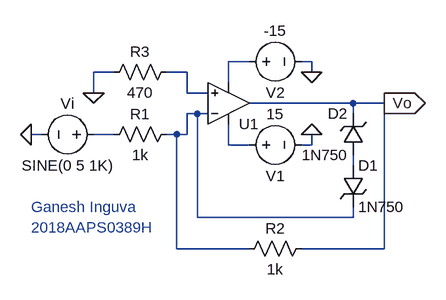
[diagram p0: schematic Run_3.asc]
Run_3.asc, the LTspice schematic file:
Version 4
SHEET 1 880 680
WIRE 80 32 48 32
WIRE 176 32 160 32
WIRE -128 48 -160 48
WIRE -16 48 -48 48
WIRE 176 48 176 32
WIRE 48 64 48 32
WIRE -160 80 -160 48
WIRE -16 80 -16 48
WIRE 16 80 -16 80
WIRE 240 96 80 96
WIRE 288 96 240 96
WIRE 0 112 -16 112
WIRE 16 112 0 112
WIRE 240 112 240 96
WIRE -240 144 -256 144
WIRE -128 144 -160 144
WIRE -32 144 -48 144
WIRE -16 144 -16 112
WIRE -16 144 -32 144
WIRE 48 160 48 128
WIRE 80 160 48 160
WIRE 176 160 176 144
WIRE 176 160 160 160
WIRE 240 192 240 176
WIRE 0 272 0 112
WIRE 240 272 240 256
WIRE 240 272 0 272
WIRE -32 320 -32 144
WIRE 80 320 -32 320
WIRE 288 320 288 96
WIRE 288 320 160 320
FLAG 176 48 0
FLAG 176 144 0
FLAG -256 144 0
FLAG -160 80 0
FLAG 288 96 Vo
IOPIN 288 96 Out
SYMBOL OpAmps\\UniversalOpamp2 48 96 M180
SYMATTR InstName U1
SYMBOL voltage 64 160 M90
WINDOW 0 32 56 VTop 2
WINDOW 3 -32 56 VBottom 2
WINDOW 123 0 0 Left 0
WINDOW 39 0 0 Left 0
SYMATTR InstName V1
SYMATTR Value 15
SYMBOL voltage 64 32 M90
WINDOW 0 32 56 VTop 2
WINDOW 3 -32 56 VBottom 2
WINDOW 123 0 0 Left 0
WINDOW 39 0 0 Left 0
SYMATTR InstName V2
SYMATTR Value -15
SYMBOL res -32 32 R90
WINDOW 0 0 56 VBottom 2
WINDOW 3 32 56 VTop 2
SYMATTR InstName R3
SYMATTR Value 470
SYMBOL res -32 128 R90
WINDOW 0 0 56 VBottom 2
WINDOW 3 32 56 VTop 2
SYMATTR InstName R1
SYMATTR Value 1k
SYMBOL voltage -144 144 R90
WINDOW 0 -32 56 VBottom 2
WINDOW 3 32 56 VTop 2
WINDOW 123 0 0 Left 0
WINDOW 39 0 0 Left 0
SYMATTR InstName Vi
SYMATTR Value SINE(0 5 1K)
SYMBOL zener 256 176 R180
WINDOW 0 24 64 Left 2
WINDOW 3 24 0 Left 2
SYMATTR InstName D2
SYMATTR Value 1N750
SYMBOL zener 224 192 R0
SYMATTR InstName D1
SYMATTR Value 1N750
SYMBOL res 176 304 R90
WINDOW 0 0 56 VBottom 2
WINDOW 3 32 56 VTop 2
SYMATTR InstName R2
SYMATTR Value 1k
TEXT -256 256 Left 2 ;Ganesh Inguva\n2018AAPS0389H

The netlist it stands for:
* Run_3.asc
XU1 N002 N003 N005 N001 Vo level.2 Avol=1Meg GBW=10Meg Slew=10Meg ilimit=25m rail=0 Vos=0 phimargin=45 en=0 enk=0 in=0 ink=0 Rin=500Meg  ; pins IN+ IN- V+ V- OUT
V1 N005 0 15
V2 N001 0 -15
R3 N002 0 470
R1 N003 N004 1k
Vi N004 0 SINE(0 5 1K)
D2 N006 Vo 1N750
D1 N006 N003 1N750
R2 Vo N003 1k
.model D D
.lib standard.dio
* Ganesh Inguva
* 2018AAPS0389H
.lib UniversalOpamps2.sub
.backanno
.end